# Altium schematic sheet Power Manage.SchDoc
size A3; SheetNumber: 6; SheetTotal: 9
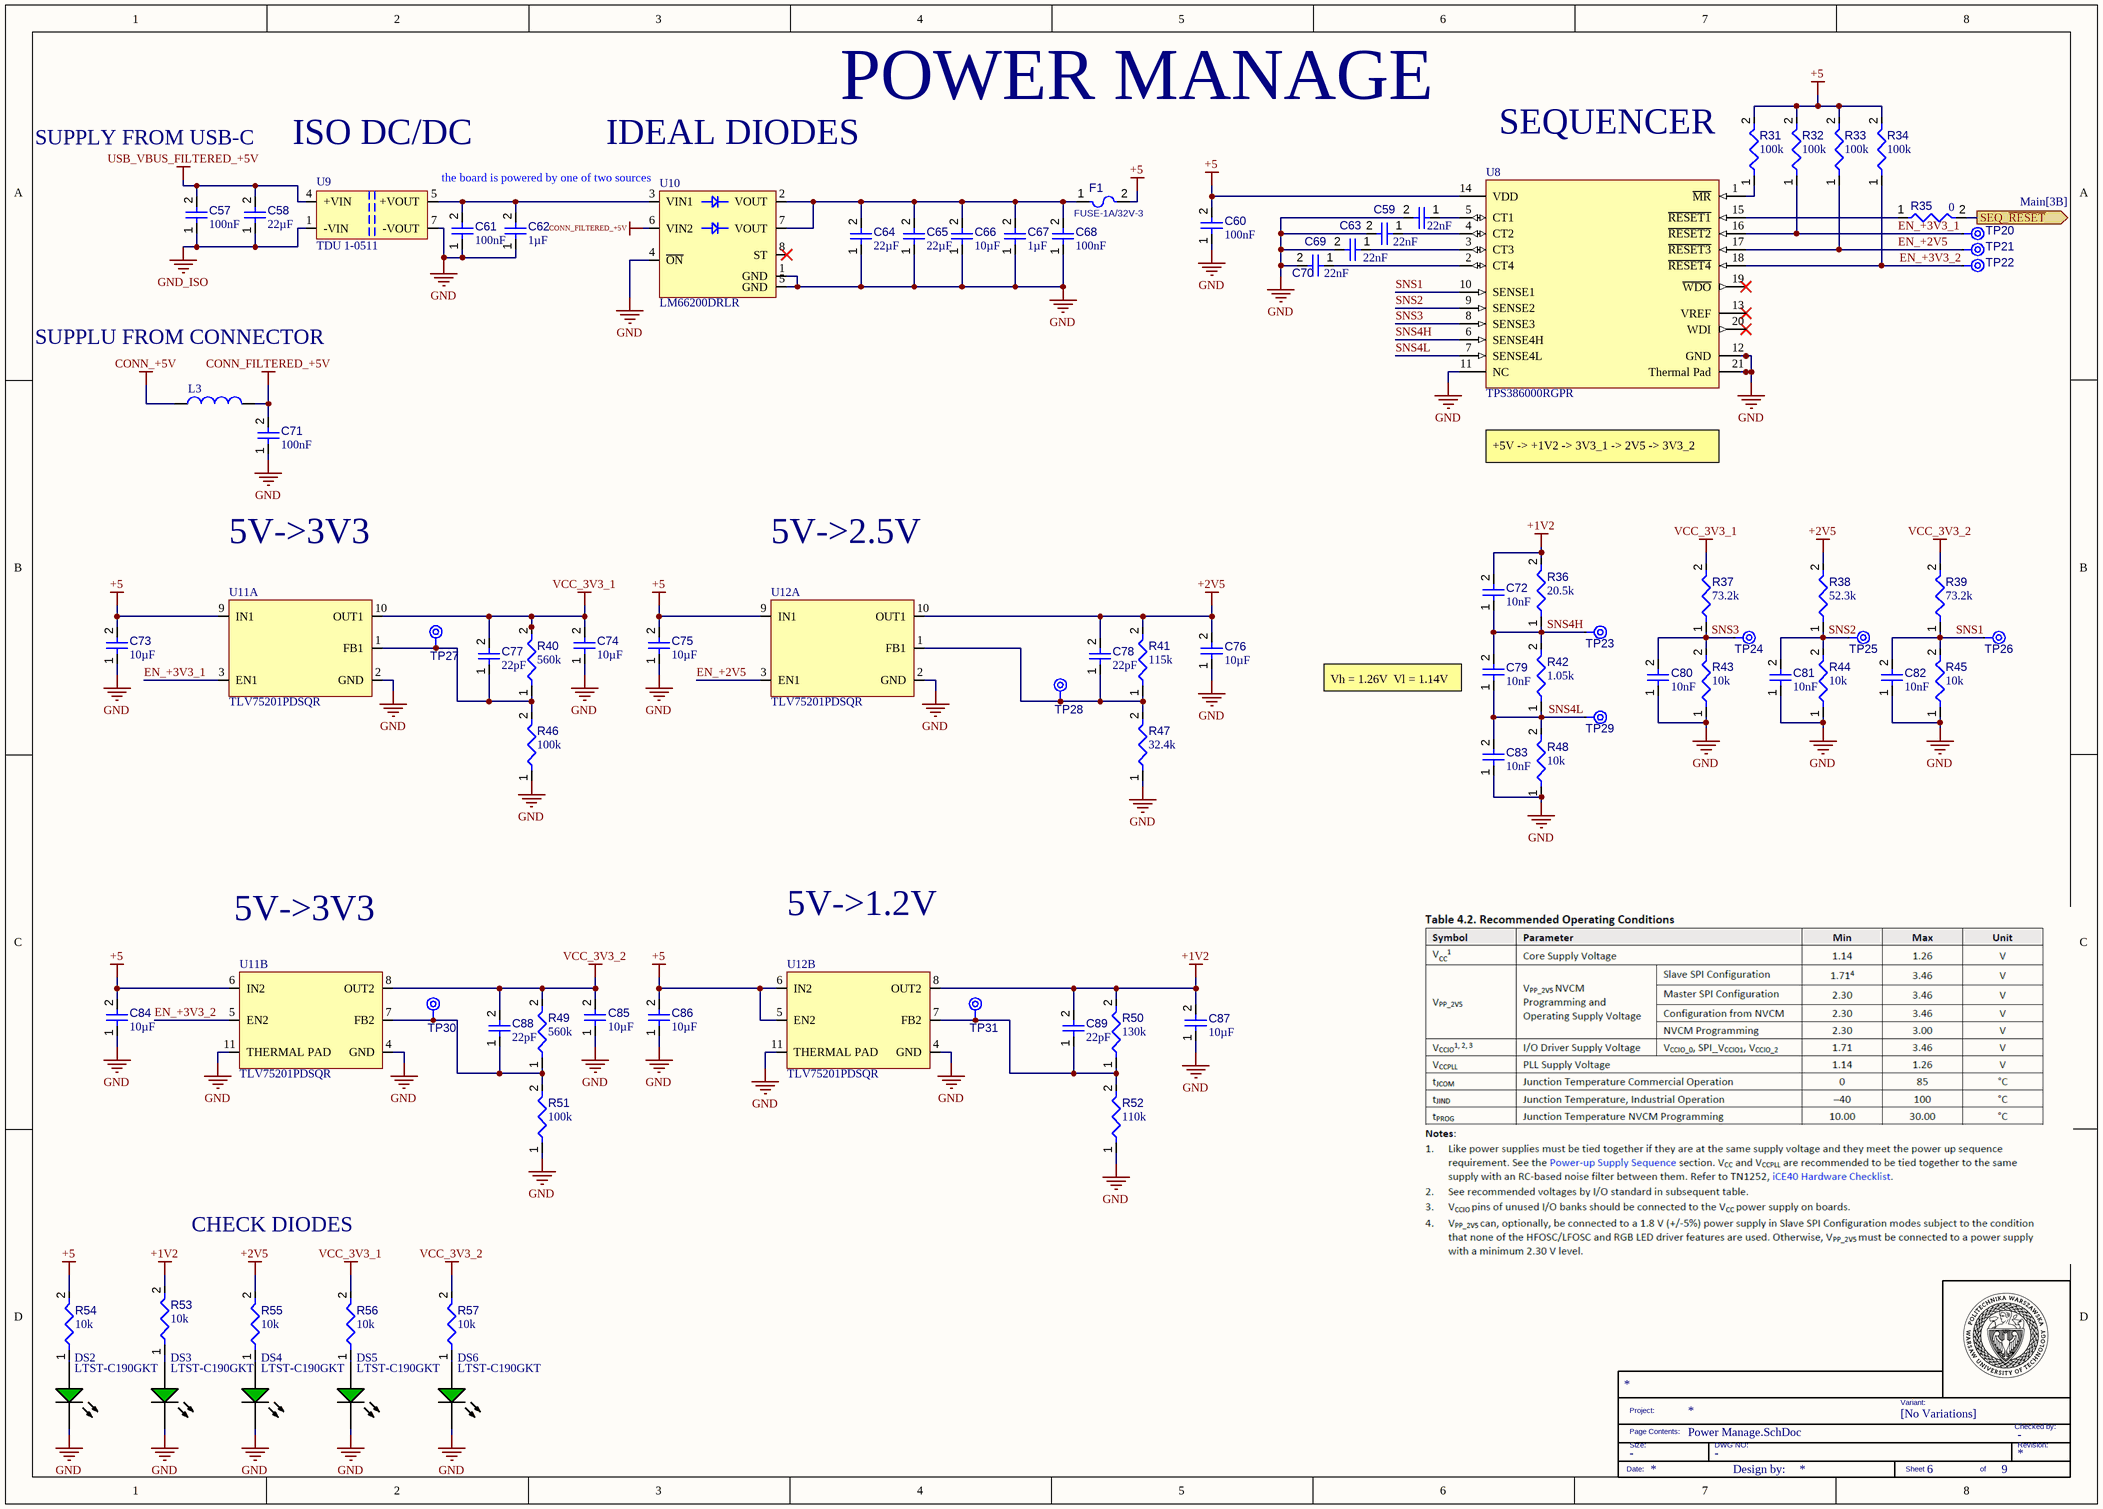
[diagram p0: Power Manage.SchDoc]

## Parts
*?  TITLE_BLOCK  (value not drawn)  (graphical)
C57  value 100nF  [FP-C0603C-CF-IPC_C]  (hidden comment: C0603C104K5RAC7411)
C58  value 22µF  [FP-GRM32E-0_3-0_2-IPC_C]  (hidden comment: GRM32ER71E226ME15K)
C59  value 22nF  [CAPC0402(1005)60_L]  (hidden comment: Capacitor 22nF +/-20% 10V 0402)
C60  value 100nF  [FP-C0603C-CF-IPC_C]  (hidden comment: C0603C104K5RAC7411)
C61  value 100nF  [FP-C0603C-CF-IPC_C]  (hidden comment: C0603C104K5RAC7411)
C62  value 1µF  [FP-CL10-IPC_B]  (hidden comment: CL10B105KA8NFNC)
C63  value 22nF  [CAPC0402(1005)60_L]  (hidden comment: Capacitor 22nF +/-20% 10V 0402)
C64  value 22µF  [FP-GRM32E-0_3-0_2-IPC_C]  (hidden comment: GRM32ER71E226ME15K)
C65  value 22µF  [FP-GRM32E-0_3-0_2-IPC_C]  (hidden comment: GRM32ER71E226ME15K)
C66  value 10µF  [CAPC3216X18N]  (hidden comment: CL31B106KAHNNNE)
C67  value 1µF  [FP-CL10-IPC_C]  (hidden comment: CL10B105KA8NFNC)
C68  value 100nF  [FP-C0603C-CF-IPC_C]  (hidden comment: C0603C104K5RAC7411)
C69  value 22nF  [CAPC0402(1005)60_L]  (hidden comment: Capacitor 22nF +/-20% 10V 0402)
C70  value 22nF  [CAPC0402(1005)60_L]  (hidden comment: Capacitor 22nF +/-20% 10V 0402)
C71  value 100nF  [FP-C0603C-CF-IPC_B]  (hidden comment: C0603C104K5RAC7411)
C72  value 10nF  [CAPC1608X90X35LL10T15]  (hidden comment: GCM188R71H103KA37J)
C73  value 10µF  [CAPC3216X18N]  (hidden comment: CL31B106KAHNNNE)
C74  value 10µF  [CAPC3216X18N]  (hidden comment: CL31B106KAHNNNE)
C75  value 10µF  [CAPC3216X18N]  (hidden comment: CL31B106KAHNNNE)
C76  value 10µF  [CAPC3216X18N]  (hidden comment: CL31B106KAHNNNE)
C77  value 22pF  [CAPC0402(1005)60_L]  (hidden comment: Capacitor 22pF +/-10% 50V 0402)
C78  value 22pF  [CAPC0402(1005)60_L]  (hidden comment: Capacitor 22pF +/-10% 50V 0402)
C79  value 10nF  [CAPC1608X90X35LL10T15]  (hidden comment: GCM188R71H103KA37J)
C80  value 10nF  [CAPC1608X90X35LL10T15]  (hidden comment: GCM188R71H103KA37J)
C81  value 10nF  [CAPC1608X90X35LL10T15]  (hidden comment: GCM188R71H103KA37J)
C82  value 10nF  [CAPC1608X90X35LL10T15]  (hidden comment: GCM188R71H103KA37J)
C83  value 10nF  [CAPC1608X90X35LL10T15]  (hidden comment: GCM188R71H103KA37J)
C84  value 10µF  [CAPC3216X18N]  (hidden comment: CL31B106KAHNNNE)
C85  value 10µF  [CAPC3216X18N]  (hidden comment: CL31B106KAHNNNE)
C86  value 10µF  [CAPC3216X18N]  (hidden comment: CL31B106KAHNNNE)
C87  value 10µF  [CAPC3216X18N]  (hidden comment: CL31B106KAHNNNE)
C88  value 22pF  [CAPC0402(1005)60_L]  (hidden comment: Capacitor 22pF +/-10% 50V 0402)
C89  value 22pF  [CAPC0402(1005)60_L]  (hidden comment: Capacitor 22pF +/-10% 50V 0402)
DS2  LTST-C190GKT  [LTST-C190GKT_V]
DS3  LTST-C190GKT  [LTST-C190GKT_V]
DS4  LTST-C190GKT  [LTST-C190GKT_V]
DS5  LTST-C190GKT  [LTST-C190GKT_V]
DS6  LTST-C190GKT  [LTST-C190GKT_V]
F1  FUSE-1A/32V-3  [LFUS-467_V]
L3  MPZ1608Y101BTA00  [FP-MPZ1608-0_8-IPC_A]  (value not drawn)
R31  value 100k  [RESC1608X55X25LL10T15]  (hidden comment: Resistor 100k +/-1% 0603 100 mW)
R32  value 100k  [RESC1608X55X25LL10T15]  (hidden comment: Resistor 100k +/-1% 0603 100 mW)
R33  value 100k  [RESC1608X55X25LL10T15]  (hidden comment: Resistor 100k +/-1% 0603 100 mW)
R34  value 100k  [RESC1608X55X25LL10T15]  (hidden comment: Resistor 100k +/-1% 0603 100 mW)
R35  value 0  [RESC0603(1608)_L]  (hidden comment: 0R3J)
R36  value 20.5k  [RESC1608X06N]  (hidden comment: CRCW060320K5FKEA)
R37  value 73.2k  [RESC1608X55X30LL15T15]  (hidden comment: ERJ-3EKF7322V)
R38  value 52.3k  [RESC1608X06N]  (hidden comment: CRCW060352K3FKEA)
R39  value 73.2k  [RESC1608X55X30LL15T15]  (hidden comment: ERJ-3EKF7322V)
R40  value 560k  [RESC1608X06N]  (hidden comment: CRCW0603560KFKEAC)
R41  value 115k  [RESC1608X06N]  (hidden comment: CRCW0603115KFKEA)
R42  value 1.05k  [RESC1608X06N]  (hidden comment: CRCW06031K05FKEAC)
R43  value 10k  [RESC1608X05N]  (hidden comment: CRCW060310K0FKTC)
R44  value 10k  [RESC1608X05N]  (hidden comment: CRCW060310K0FKTC)
R45  value 10k  [RESC1608X05N]  (hidden comment: CRCW060310K0FKTC)
R46  value 100k  [RESC1608X55X25LL10T15]  (hidden comment: Resistor 100k +/-1% 0603 100 mW)
R47  value 32.4k  [RESC1608X06N]  (hidden comment: CRCW060332K4FKEA)
R48  value 10k  [RESC1608X05N]  (hidden comment: CRCW060310K0FKTC)
R49  value 560k  [RESC1608X06N]  (hidden comment: CRCW0603560KFKEAC)
R50  value 130k  [RESC1608X06N]  (hidden comment: CRCW0603130KFKEAC)
R51  value 100k  [RESC1608X55X25LL10T15]  (hidden comment: Resistor 100k +/-1% 0603 100 mW)
R52  value 110k  [RESC1608X06N]  (hidden comment: CRCW0603110KFKEAC)
R53  value 10k  [RESC1608X05N]  (hidden comment: CRCW060310K0FKTC)
R54  value 10k  [RESC1608X05N]  (hidden comment: CRCW060310K0FKTC)
R55  value 10k  [RESC1608X05N]  (hidden comment: CRCW060310K0FKTC)
R56  value 10k  [RESC1608X05N]  (hidden comment: CRCW060310K0FKTC)
R57  value 10k  [RESC1608X05N]  (hidden comment: CRCW060310K0FKTC)
TP20  TPAD6R  [TP06R]  (value not drawn)  (no BOM)
TP21  TPAD6R  [TP06R]  (value not drawn)  (no BOM)
TP22  TPAD6R  [TP06R]  (value not drawn)  (no BOM)
TP23  TPAD6R  [TP06R]  (value not drawn)  (no BOM)
TP24  TPAD6R  [TP06R]  (value not drawn)  (no BOM)
TP25  TPAD6R  [TP06R]  (value not drawn)  (no BOM)
TP26  TPAD6R  [TP06R]  (value not drawn)  (no BOM)
TP27  TPAD6R  [TP06R]  (value not drawn)  (no BOM)
TP28  TPAD6R  [TP06R]  (value not drawn)  (no BOM)
TP29  TPAD6R  [TP06R]  (value not drawn)  (no BOM)
TP30  TPAD6R  [TP06R]  (value not drawn)  (no BOM)
TP31  TPAD6R  [TP06R]  (value not drawn)  (no BOM)
U8  TPS386000RGPR  [FP-RGP0020A-IPC_C]
U9  TDU 1-0511  [RELAY_TDU1_TRP]
U10  LM66200DRLR  [LM66200DRLR-Footprint-1]
U11  TLV75201PDSQR  [SON40P200X80_HS-11N]  (parts A,B of 2)
U12  TLV75201PDSQR  [SON40P200X80_HS-11N]  (parts A,B of 2)

## Ports
SEQ_~{RESET} (out, see Main[3B])

## Nets
+1V2: C72.2 C87.2 C89.2 R36.2 R50.2 R53.2 U12.8(OUT2)
+2V5: C76.2 C78.2 R38.2 R41.2 R55.2 U12.10(OUT1)
+5: C60.2 C73.2 C75.2 C84.2 C86.2 F1.2 R31.2 R32.2 R33.2 R34.2 R54.2 U8.14(VDD) U11.6(IN2) U11.9(IN1) U12.5(EN2) U12.6(IN2) U12.9(IN1)
CONN_+5V: L3.1
CONN_FILTERED_+5V: C71.2 L3.2 U10.6(VIN2)
GND: C59.2 C60.1 C61.1 C62.1 C63.2 C64.1 C65.1 C66.1 C67.1 C68.1 C69.2 C70.2 C71.1 C73.1 C74.1 C75.1 C76.1 C80.1 C81.1 C82.1 C83.1 C84.1 C85.1 C86.1 C87.1 DS2.2(K) DS3.2(K) DS4.2(K) DS5.2(K) DS6.2(K) R43.1 R44.1 R45.1 R46.1 R47.1 R48.1 R51.1 R52.1 U8.11(NC) U8.12(GND) U8.21(Thermal_Pad) U9.7(-VOUT) U10.1(GND) U10.4(~{ON}) U10.5(GND) U11.2(GND) U11.4(GND) U11.11(THERMAL_PAD) U12.2(GND) U12.4(GND) U12.11(THERMAL_PAD)
GND_ISO: C57.1 C58.1 U9.1(-VIN)
USB_VBUS_FILTERED_+5V: C57.2 C58.2 U9.4(+VIN)
VCC_3V3_1: C74.2 C77.2 R37.2 R40.2 R56.2 U11.10(OUT1)
VCC_3V3_2: C85.2 C88.2 R39.2 R49.2 R57.2 U11.8(OUT2)
EN_+2V5: R33.1 TP21.1(TP) U8.17(~{RESET3}) U12.3(EN1)
EN_+3V3_1: R32.1 TP20.1(TP) U8.16(~{RESET2}) U11.3(EN1)
EN_+3V3_2: R34.1 TP22.1(TP) U8.18(~{RESET4}) U11.5(EN2)
SEQ_~{RESET}: R35.2 ; port SEQ_~{RESET}
SNS1: C82.2 R39.1 R45.2 TP26.1(TP) U8.10(SENSE1)
SNS2: C81.2 R38.1 R44.2 TP25.1(TP) U8.9(SENSE2)
SNS3: C80.2 R37.1 R43.2 TP24.1(TP) U8.8(SENSE3)
SNS4H: C72.1 C79.2 R36.1 R42.2 TP23.1(TP) U8.6(SENSE4H)
SNS4L: C79.1 C83.2 R42.1 R48.2 TP29.1(TP) U8.7(SENSE4L)
NetC59_1: C59.1 U8.5(CT1)
NetC61_2: C61.2 C62.2 U9.5(+VOUT) U10.3(VIN1)
NetC63_1: C63.1 U8.4(CT2)
NetC64_2: C64.2 C65.2 C66.2 C67.2 C68.2 F1.1 U10.2(VOUT) U10.7(VOUT)
NetC69_1: C69.1 U8.3(CT3)
NetC70_1: C70.1 U8.2(CT4)
NetC77_1: C77.1 R40.1 R46.2 TP27.1(TP) U11.1(FB1)
NetC78_1: C78.1 R41.1 R47.2 TP28.1(TP) U12.1(FB1)
NetC88_1: C88.1 R49.1 R51.2 TP30.1(TP) U11.7(FB2)
NetC89_1: C89.1 R50.1 R52.2 TP31.1(TP) U12.7(FB2)
NetDS2_1: DS2.1(A) R54.1
NetDS3_1: DS3.1(A) R53.1
NetDS4_1: DS4.1(A) R55.1
NetDS5_1: DS5.1(A) R56.1
NetDS6_1: DS6.1(A) R57.1
NetR31_1: R31.1 U8.1(~{MR})
NetR35_1: R35.1 U8.15(~{RESET1})

Not connected (* = marked no-connect by the designer): U8 13(VREF)* 19(~{WDO})* 20(WDI)*; U10 8(ST)*

## Notes on the sheet
- POWER MANAGE
- SUPPLY FROM USB-C
- ISO DC/DC
- the board is powered by one of two sources
- (near U10) IDEAL DIODES
- (near U8) SEQUENCER
- SUPPLU FROM CONNECTOR
- +5V -> +1V2 -> 3V3_1 -> 2V5 -> 3V3_2
- 5V->3V3
- 5V->2.5V
- (near C79) Vh = 1.26V  Vl = 1.14V
- 5V->1.2V
- CHECK DIODES
- (in symbol CMP-003-000005-7) Variant:; Project:; [No Variations]; Checked by:; Page Contents:; Size:; DWG NO:; Revision:; Date:; Design by:; Sheet; of

## Library data of the parts
*? = CMP-003-000005-7: TITLEBLOCK; DWG NO: -; Size: -; Checked by: -; Design Item ID: TITLE_BLOCK; Source: TITLEBLOCK.SchLib
C57 C60 C61 C68 C71 = CMP-001-00086-8: Ceramic Capacitor, Multilayer, Ceramic, 50V, 10% +Tol, 10% -Tol, X7R, 15% TC, 0.1uF, Surface Mount, 0603; Capacitor Type: Ceramic; Max Operating Temperature: 125°C; Case/Package: 0603; Pins: 2; Min Operating Temperature: -55°C; RoHS Compliant: Yes; Mounting Technology: Surface Mount
C58 C64 C65 = CMP-001-00084-6: Ceramic Capacitor, Multilayer, Ceramic, 25V, 20% +Tol, 20% -Tol, X7R, 15% TC, 22uF, Surface Mount, 1210; Pins: 2; RoHS Compliant: Yes; Max Operating Temperature: 125°C; Min Operating Temperature: -55°C; Capacitor Type: Ceramic; Case/Package: 1210; Mounting Technology: Surface Mount
C59 C63 C69 C70 = CMP-001-00062-4: Chip Capacitor, 22nF +/-20%, 10V, 0402, Thickness 0.6 mm; Tolerance: 10%; Min Operating Temperature: -55°C; Case/Package: 0402; Pins: 2; Max Operating Temperature: 85°C; Mounting Technology: SMT; Voltage Rating: 10V
C62 C67 = CMP-001-00085-5: Ceramic Capacitor, Multilayer, Ceramic, 25V, 10% +Tol, 10% -Tol, X7R, 15% TC, 1uF, Surface Mount, 0603; Max Operating Temperature: 125°C; Pins: 2; RoHS Compliant: Yes; Min Operating Temperature: -55°C; Capacitor Type: Ceramic; Mounting Technology: Surface Mount; Case/Package: 0603
C66 C73-C76 C84-C87 = CMP-001-00088-3: Ceramic Capacitor, Multilayer, Ceramic, 25V, 10% +Tol, 10% -Tol, X7R, 15% TC, 10uF, Surface Mount, 1206; Max Operating Temperature: 125°C; Mounting Technology: Surface Mount; Pins: 2; Case/Package: 1206; Min Operating Temperature: -55°C; Voltage Rating: 25V; Capacitor Type: Ceramic; RoHS Compliant: Yes
C72 C79-C83 = CMP-001-00231-2: Ceramic Capacitor, Multilayer, Ceramic, 50V, 10% +Tol, 10% -Tol, X7R, 15% TC, 0.01uF, Surface Mount, 0603; Min Operating Temperature: -55°C; Voltage Rating: 50V; Max Operating Temperature: 125°C; Tolerance: 10%; Capacitor Type: Ceramic; Mounting Technology: Surface Mount; RoHS Compliant: Yes; Case/Package: 0603; Pins: 2
C77 C78 C88 C89 = CMP-001-00073-4: Chip Capacitor, 22pF +/-10%, 50V, 0402, Thickness 0.6 mm; Tolerance: 10%; Pins: 2; Voltage Rating: 50V; Max Operating Temperature: 85°C; Min Operating Temperature: -55°C; Mounting Technology: SMT; Case/Package: 0402
DS2-DS6 = CMP-007-00022-2: LED Uni-Color Green, 100 mW, 30 mA, -55 to 85 degC, 2-Pin SMD, RoHS, Tape and Reel; Manufacturer: Lite-On; Power: 100mW; Forward Voltage: 2.1V; Viewing Angle: 130degrees; Forward Current: 20mA; Luminous Intensity: 6mcd; Lens Style: Clear; Manufacturer URL: http://www.us.liteon.com/; RoHS Compliant: True; Colour: Green; Package Description: 2-Pin Surface Mount Device, Body 1.6 x 0.8 mm; Datasheet URL: http://datasheet.octopart.com/LTST-C190GKT-Lite-On-datasheet-158530.pdf; Datasheet Version: Dec-06; Mounting Technology: SM; Case/Package: 0603; Package Reference: C190GKT; Packaging: TapeandReel; Min Operating Temperature: -55°C; Nominal Vf: 2.1V; Package Quantity: 3000; Illumination Colour: Green; Max Operating Temperature: 85°C; Pins: 2
F1 = CMP-005-00012-2: Fast Acting Fuse, 1 A, 32 V, -55 to 90 degC, 2-Pin SMD, RoHS, Tape and Reel; Current Rating: 1A; Case/Package: LFUS-467; Pins: 2
L3 = CMP-006-00024-1: Ferrite Chip, 1 Function(s), 2A, 2 Pin(s); Tolerance: 25%; Current Rating: 2A; RoHS Compliant: Yes; Pins: 2; Max Operating Temperature: 125°C; Mounting Technology: Surface Mount; Case/Package: 0603; Min Operating Temperature: -55°C; Max Current Rating: 2A
R31-R34 R46 R51 = CMP-009-00023-6: Chip Resistor, 100 KOhm, +/- 1%, 0.1 W, -55 to 155 degC, 0603 (1608 Metric); Voltage Rating: 50V; Power: 100mW; Max Operating Temperature: 155°C; RoHS Compliant: True; Tolerance: 1%; Pins: 2; Case/Package: 0603; Mounting Technology: SM; Min Operating Temperature: -55°C
R35 = CMP-009-00063-3: Jumper 0603 (1608 Metric); Case/Package: 0603; Mounting Technology: SMT; Pins: 2
R36 = CMP-009-00210-3: Fixed Resistor, Metal Glaze/thick Film, 0.1W, 20500ohm, 75V, 1% +/-Tol, 100ppm/Cel, Surface Mount, 0603; Power: 100mW; Tolerance: 1%; RoHS Compliant: Yes; Max Operating Temperature: 155°C; Pins: 2; Min Operating Temperature: -55°C; Mounting Technology: Surface Mount; Case/Package: 0603
R37 R39 = CMP-009-00178-2: Fixed Resistor, Metal Glaze/thick Film, 0.1W, 73200ohm, 75V, 1% +/-Tol, 100ppm/Cel, Surface Mount, 0603; Power: 100mW; Mounting Technology: Surface Mount; RoHS Compliant: Yes; Max Operating Temperature: 155°C; Pins: 2; Tolerance: 1%; Min Operating Temperature: -55°C; Voltage Rating: 75V; Case/Package: 0603
R38 = CMP-009-00206-3: Fixed Resistor, Metal Glaze/thick Film, 0.1W, 52300ohm, 75V, 1% +/-Tol, 100ppm/Cel, Surface Mount, 0603; Power: 100mW; Pins: 2; Tolerance: 1%; Case/Package: 0603; Min Operating Temperature: -55°C; RoHS Compliant: Yes; Max Operating Temperature: 155°C; Mounting Technology: Surface Mount
R40 R49 = CMP-009-00200-3: Fixed Resistor, Metal Glaze/thick Film, 0.1W, 560000ohm, 75V, 1% +/-Tol, 100ppm/Cel, Surface Mount, 0603; Power: 100mW; Min Operating Temperature: -55°C; Case/Package: 0603; RoHS Compliant: Yes; Max Operating Temperature: 155°C; Pins: 2; Tolerance: 1%
R41 = CMP-009-00203-3: Fixed Resistor, Metal Glaze/thick Film, 0.1W, 115000ohm, 75V, 1% +/-Tol, 100ppm/Cel, Surface Mount, 0603; Power: 100mW; Case/Package: 0603; RoHS Compliant: Yes; Pins: 2; Min Operating Temperature: -55°C; Max Operating Temperature: 155°C; Tolerance: 1%; Mounting Technology: Surface Mount
R42 = CMP-009-00209-3: Fixed Resistor, Metal Glaze/thick Film, 0.1W, 1050ohm, 75V, 1% +/-Tol, 100ppm/Cel, Surface Mount, 0603; Power: 100mW; Tolerance: 1%; Mounting Technology: Surface Mount; Pins: 2; Min Operating Temperature: -55°C; Max Operating Temperature: 155°C; RoHS Compliant: Yes; Case/Package: 0603
R43-R45 R48 = CMP-009-00187-3: Fixed Resistor, Metal Glaze/thick Film, 0.1W, 10000ohm, 75V, 1% +/-Tol, 100ppm/Cel, Surface Mount, 0603; Power: 100mW; Voltage Rating: 75V; Case/Package: 0603; Tolerance: 1%; Min Operating Temperature: -55°C; Mounting Technology: Surface Mount; Max Operating Temperature: 155°C; RoHS Compliant: No; Pins: 2
R47 = CMP-009-00204-3: Fixed Resistor, Metal Glaze/thick Film, 0.1W, 32400ohm, 75V, 1% +/-Tol, 100ppm/Cel, Surface Mount, 0603; Power: 100mW; Tolerance: 1%; Min Operating Temperature: -55°C; Mounting Technology: Surface Mount; Pins: 2; Max Operating Temperature: 155°C; RoHS Compliant: Yes; Case/Package: 0603
R50 = CMP-009-00202-3: Fixed Resistor, Metal Glaze/thick Film, 0.1W, 130000ohm, 75V, 1% +/-Tol, 100ppm/Cel, Surface Mount, 0603; Power: 100mW; Case/Package: 0603; Min Operating Temperature: -55°C; Pins: 2; Max Operating Temperature: 155°C; Tolerance: 1%; RoHS Compliant: Yes
R52 = CMP-009-00201-3: Fixed Resistor, Metal Glaze/thick Film, 0.1W, 110000ohm, 75V, 1% +/-Tol, 100ppm/Cel, Surface Mount, 0603; Power: 100mW; RoHS Compliant: Yes; Max Operating Temperature: 155°C; Case/Package: 0603; Pins: 2; Min Operating Temperature: -55°C; Tolerance: 1%
R53-R57 = CMP-009-00187-2: Fixed Resistor, Metal Glaze/thick Film, 0.1W, 10000ohm, 75V, 1% +/-Tol, 100ppm/Cel, Surface Mount, 0603; Power: 100mW; Voltage Rating: 75V; Case/Package: 0603; Tolerance: 1%; Min Operating Temperature: -55°C; Mounting Technology: Surface Mount; Max Operating Temperature: 155°C; RoHS Compliant: No; Pins: 2
TP20-TP31 = CMP-00028-00002-3: 0.6mm round; Pins: 1
U8 = CMP-031-00020-3: Power Supply Management Circuit, Adjustable, 4 Channel, PQCC20; Max Supply Voltage: 6.5V; Min Supply Voltage: 1.8V; Case/Package: HVQCCN; RoHS Compliant: Yes; Min Operating Temperature: -40°C; Max Operating Temperature: 125°C; Pins: 20
U9 = CMP-019-00050-2: DC-DC Converter, 1W, 4.5-5.5Vin, 5Vout, 200mA, Encapsulated DIP8, TDU 1 Series
U10 = CMP-031-00022-3: 1.6-V to 5.5-V, 40-mΩ, 2.5-A, low-IQ, dual ideal diode 8-SOT-5X3 -40 to 125; Max Supply Voltage: 5.5V; Min Supply Voltage: 0V; Case/Package: SOT-5X3-8; Max Operating Temperature: 125°C; Pins: 8
U11 U12 = CMP-031-00021-3: Adjustable Positive LDO Regulator, 2 Output, 0.55V1 Min, 0.55V2 Min, 5.5V1 Max, 5.5V2 Max, PDSO10